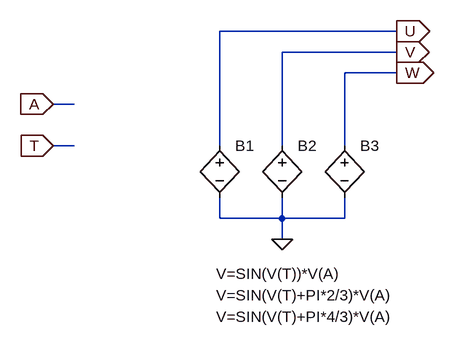
[diagram p0: schematic 3ph_gen.asc]
3ph_gen.asc, the LTspice schematic file:
Version 4
SHEET 1 880 680
WIRE 512 32 240 32
WIRE 512 64 336 64
WIRE 512 96 432 96
WIRE 16 144 -16 144
WIRE 16 208 -16 208
WIRE 240 208 240 32
WIRE 336 208 336 64
WIRE 432 208 432 96
WIRE 240 320 240 288
WIRE 336 320 336 288
WIRE 336 320 240 320
WIRE 432 320 432 288
WIRE 432 320 336 320
WIRE 336 352 336 320
FLAG 336 352 0
FLAG 512 32 U
IOPIN 512 32 Out
FLAG 512 64 V
IOPIN 512 64 Out
FLAG 512 96 W
IOPIN 512 96 Out
FLAG -16 144 A
IOPIN -16 144 In
FLAG -16 208 T
IOPIN -16 208 In
SYMBOL bv 240 192 R0
WINDOW 3 -5 213 Left 2
SYMATTR InstName B1
SYMATTR Value V=SIN(V(T))*V(A)
SYMBOL bv 336 192 R0
WINDOW 3 -101 246 Left 2
SYMATTR InstName B2
SYMATTR Value V=SIN(V(T)+PI*2/3)*V(A)
SYMBOL bv 432 192 R0
WINDOW 3 -197 279 Left 2
SYMATTR InstName B3
SYMATTR Value V=SIN(V(T)+PI*4/3)*V(A)

The netlist it stands for:
* 3ph_gen.asc
B1 U 0 V=SIN(V(T))*V(A)
B2 V 0 V=SIN(V(T)+PI*2/3)*V(A)
B3 W 0 V=SIN(V(T)+PI*4/3)*V(A)
.backanno
.end